# Altium schematic sheet TestKitSch.SchDoc
size A2
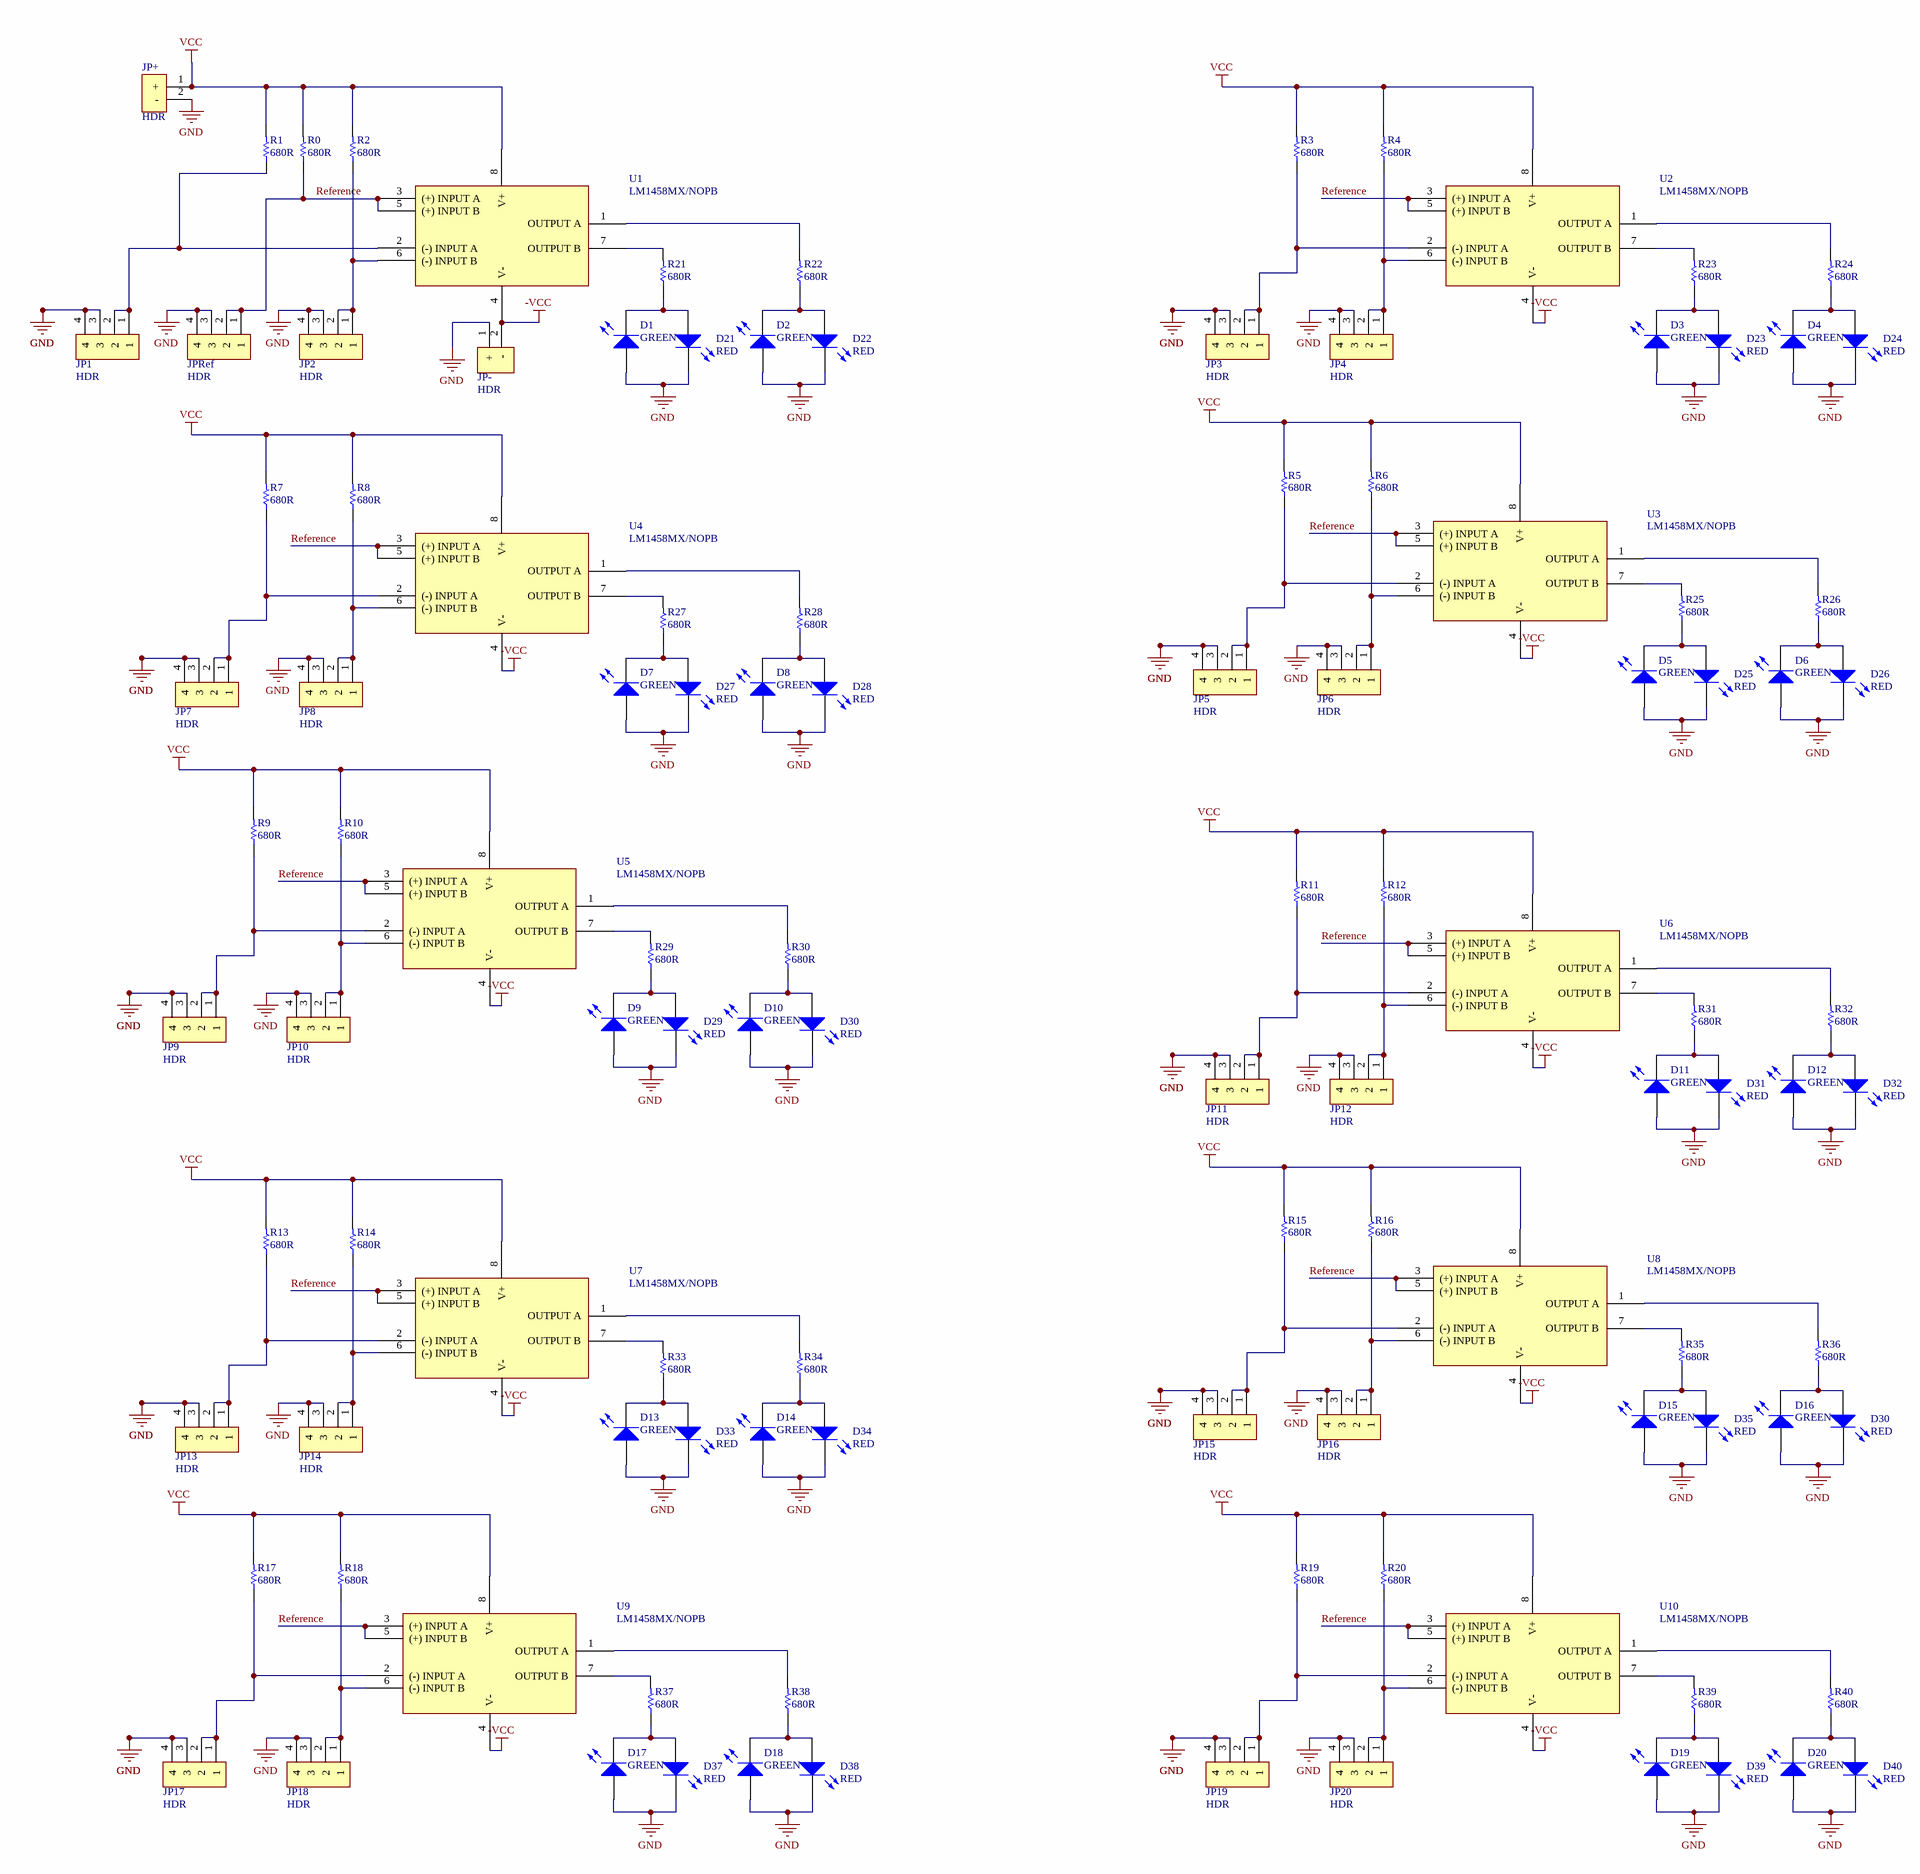
[diagram p0: TestKitSch.SchDoc]

## Parts
(Parts that share a designator on the sheet are numbered #1, #2 ... from top to bottom, then left to right.)
D1  GREEN  [2835_LED_GREEN]
D2  GREEN  [2835_LED_GREEN]
D3  GREEN  [2835_LED_GREEN]
D4  GREEN  [2835_LED_GREEN]
D5  GREEN  [2835_LED_GREEN]
D6  GREEN  [2835_LED_GREEN]
D7  GREEN  [2835_LED_GREEN]
D8  GREEN  [2835_LED_GREEN]
D9  GREEN  [2835_LED_GREEN]
D10  GREEN  [2835_LED_GREEN]
D11  GREEN  [2835_LED_GREEN]
D12  GREEN  [2835_LED_GREEN]
D13  GREEN  [2835_LED_GREEN]
D14  GREEN  [2835_LED_GREEN]
D15  GREEN  [2835_LED_GREEN]
D16  GREEN  [2835_LED_GREEN]
D17  GREEN  [2835_LED_GREEN]
D18  GREEN  [2835_LED_GREEN]
D19  GREEN  [2835_LED_GREEN]
D20  GREEN  [2835_LED_GREEN]
D21  RED  [2835_LED_RED]
D22  RED  [2835_LED_RED]
D23  RED  [2835_LED_RED]
D24  RED  [2835_LED_RED]
D25  RED  [2835_LED_RED]
D26  RED  [2835_LED_RED]
D27  RED  [2835_LED_RED]
D28  RED  [2835_LED_RED]
D29  RED  [2835_LED_RED]
D30#1  RED  [2835_LED_RED]
D30#2  RED  [2835_LED_RED]
D31  RED  [2835_LED_RED]
D32  RED  [2835_LED_RED]
D33  RED  [2835_LED_RED]
D34  RED  [2835_LED_RED]
D35  RED  [2835_LED_RED]
D37  RED  [2835_LED_RED]
D38  RED  [2835_LED_RED]
D39  RED  [2835_LED_RED]
D40  RED  [2835_LED_RED]
JP1  HDR  [Hdr_Famela_1x4_2.54mm]
JP2  HDR  [Hdr_Famela_1x4_2.54mm]
JP3  HDR  [Hdr_Famela_1x4_2.54mm]
JP4  HDR  [Hdr_Famela_1x4_2.54mm]
JP5  HDR  [Hdr_Famela_1x4_2.54mm]
JP6  HDR  [Hdr_Famela_1x4_2.54mm]
JP7  HDR  [Hdr_Famela_1x4_2.54mm]
JP8  HDR  [Hdr_Famela_1x4_2.54mm]
JP9  HDR  [Hdr_Famela_1x4_2.54mm]
JP10  HDR  [Hdr_Famela_1x4_2.54mm]
JP11  HDR  [Hdr_Famela_1x4_2.54mm]
JP12  HDR  [Hdr_Famela_1x4_2.54mm]
JP13  HDR  [Hdr_Famela_1x4_2.54mm]
JP14  HDR  [Hdr_Famela_1x4_2.54mm]
JP15  HDR  [Hdr_Famela_1x4_2.54mm]
JP16  HDR  [Hdr_Famela_1x4_2.54mm]
JP17  HDR  [Hdr_Famela_1x4_2.54mm]
JP18  HDR  [Hdr_Famela_1x4_2.54mm]
JP19  HDR  [Hdr_Famela_1x4_2.54mm]
JP20  HDR  [Hdr_Famela_1x4_2.54mm]
JP+  HDR  [HDR_MALE_2X1_2.54]
JP-  HDR  [HDR_MALE_2X1_2.54]
JPRef  HDR  [Hdr_Famela_1x4_2.54mm]
R0  680R  [R0805]
R1  680R  [R0805]
R2  680R  [R0805]
R3  680R  [R0805]
R4  680R  [R0805]
R5  680R  [R0805]
R6  680R  [R0805]
R7  680R  [R0805]
R8  680R  [R0805]
R9  680R  [R0805]
R10  680R  [R0805]
R11  680R  [R0805]
R12  680R  [R0805]
R13  680R  [R0805]
R14  680R  [R0805]
R15  680R  [R0805]
R16  680R  [R0805]
R17  680R  [R0805]
R18  680R  [R0805]
R19  680R  [R0805]
R20  680R  [R0805]
R21  680R  [R0805]
R22  680R  [R0805]
R23  680R  [R0805]
R24  680R  [R0805]
R25  680R  [R0805]
R26  680R  [R0805]
R27  680R  [R0805]
R28  680R  [R0805]
R29  680R  [R0805]
R30  680R  [R0805]
R31  680R  [R0805]
R32  680R  [R0805]
R33  680R  [R0805]
R34  680R  [R0805]
R35  680R  [R0805]
R36  680R  [R0805]
R37  680R  [R0805]
R38  680R  [R0805]
R39  680R  [R0805]
R40  680R  [R0805]
U1  LM1458MX/NOPB  [SOIC8]
U2  LM1458MX/NOPB  [SOIC8]
U3  LM1458MX/NOPB  [SOIC8]
U4  LM1458MX/NOPB  [SOIC8]
U5  LM1458MX/NOPB  [SOIC8]
U6  LM1458MX/NOPB  [SOIC8]
U7  LM1458MX/NOPB  [SOIC8]
U8  LM1458MX/NOPB  [SOIC8]
U9  LM1458MX/NOPB  [SOIC8]
U10  LM1458MX/NOPB  [SOIC8]

## Nets
-VCC: JP-.2(-) U1.4(V-) U2.4(V-) U3.4(V-) U4.4(V-) U5.4(V-) U6.4(V-) U7.4(V-) U8.4(V-) U9.4(V-) U10.4(V-)
GND: D1.1(A) D2.1(A) D3.1(A) D4.1(A) D5.1(A) D6.1(A) D7.1(A) D8.1(A) D9.1(A) D10.1(A) D11.1(A) D12.1(A) D13.1(A) D14.1(A) D15.1(A) D16.1(A) D17.1(A) D18.1(A) D19.1(A) D20.1(A) D21.2(K) D22.2(K) D23.2(K) D24.2(K) D25.2(K) D26.2(K) D27.2(K) D28.2(K) D29.2(K) D30#1.2(K) D30#2.2(K) D31.2(K) D32.2(K) D33.2(K) D34.2(K) D35.2(K) D37.2(K) D38.2(K) D39.2(K) D40.2(K) JP1.3 JP1.4 JP2.3 JP2.4 JP3.3 JP3.4 JP4.3 JP4.4 JP5.3 JP5.4 JP6.3 JP6.4 JP7.3 JP7.4 JP8.3 JP8.4 JP9.3 JP9.4 JP10.3 JP10.4 JP11.3 JP11.4 JP12.3 JP12.4 JP13.3 JP13.4 JP14.3 JP14.4 JP15.3 JP15.4 JP16.3 JP16.4 JP17.3 JP17.4 JP18.3 JP18.4 JP19.3 JP19.4 JP20.3 JP20.4 JP+.2(-) JP-.1(+) JPRef.3 JPRef.4
VCC: JP+.1(+) R0.2 R1.2 R2.2 R3.2 R4.2 R5.2 R6.2 R7.2 R8.2 R9.2 R10.2 R11.2 R12.2 R13.2 R14.2 R15.2 R16.2 R17.2 R18.2 R19.2 R20.2 U1.8(V+) U2.8(V+) U3.8(V+) U4.8(V+) U5.8(V+) U6.8(V+) U7.8(V+) U8.8(V+) U9.8(V+) U10.8(V+)
Reference: JPRef.1 JPRef.2 R0.1 U1.3((+)_INPUT_A) U1.5((+)_INPUT_B) U2.3((+)_INPUT_A) U2.5((+)_INPUT_B) U3.3((+)_INPUT_A) U3.5((+)_INPUT_B) U4.3((+)_INPUT_A) U4.5((+)_INPUT_B) U5.3((+)_INPUT_A) U5.5((+)_INPUT_B) U6.3((+)_INPUT_A) U6.5((+)_INPUT_B) U7.3((+)_INPUT_A) U7.5((+)_INPUT_B) U8.3((+)_INPUT_A) U8.5((+)_INPUT_B) U9.3((+)_INPUT_A) U9.5((+)_INPUT_B) U10.3((+)_INPUT_A) U10.5((+)_INPUT_B)
NetD1_2: D1.2(K) D21.1(A) R21.1
NetD2_2: D2.2(K) D22.1(A) R22.1
NetD3_2: D3.2(K) D23.1(A) R23.1
NetD4_2: D4.2(K) D24.1(A) R24.1
NetD5_2: D5.2(K) D25.1(A) R25.1
NetD6_2: D6.2(K) D26.1(A) R26.1
NetD7_2: D7.2(K) D27.1(A) R27.1
NetD8_2: D8.2(K) D28.1(A) R28.1
NetD9_2: D9.2(K) D29.1(A) R29.1
NetD10_2: D10.2(K) D30#1.1(A) R30.1
NetD11_2: D11.2(K) D31.1(A) R31.1
NetD12_2: D12.2(K) D32.1(A) R32.1
NetD13_2: D13.2(K) D33.1(A) R33.1
NetD14_2: D14.2(K) D34.1(A) R34.1
NetD15_2: D15.2(K) D35.1(A) R35.1
NetD16_2: D16.2(K) D30#2.1(A) R36.1
NetD17_2: D17.2(K) D37.1(A) R37.1
NetD18_2: D18.2(K) D38.1(A) R38.1
NetD19_2: D19.2(K) D39.1(A) R39.1
NetD20_2: D20.2(K) D40.1(A) R40.1
NetJP1_1: JP1.1 JP1.2 R1.1 U1.2((-)_INPUT_A)
NetJP2_1: JP2.1 JP2.2 R2.1 U1.6((-)_INPUT_B)
NetJP3_1: JP3.1 JP3.2 R3.1 U2.2((-)_INPUT_A)
NetJP4_1: JP4.1 JP4.2 R4.1 U2.6((-)_INPUT_B)
NetJP5_1: JP5.1 JP5.2 R5.1 U3.2((-)_INPUT_A)
NetJP6_1: JP6.1 JP6.2 R6.1 U3.6((-)_INPUT_B)
NetJP7_1: JP7.1 JP7.2 R7.1 U4.2((-)_INPUT_A)
NetJP8_1: JP8.1 JP8.2 R8.1 U4.6((-)_INPUT_B)
NetJP9_1: JP9.1 JP9.2 R9.1 U5.2((-)_INPUT_A)
NetJP10_1: JP10.1 JP10.2 R10.1 U5.6((-)_INPUT_B)
NetJP11_1: JP11.1 JP11.2 R11.1 U6.2((-)_INPUT_A)
NetJP12_1: JP12.1 JP12.2 R12.1 U6.6((-)_INPUT_B)
NetJP13_1: JP13.1 JP13.2 R13.1 U7.2((-)_INPUT_A)
NetJP14_1: JP14.1 JP14.2 R14.1 U7.6((-)_INPUT_B)
NetJP15_1: JP15.1 JP15.2 R15.1 U8.2((-)_INPUT_A)
NetJP16_1: JP16.1 JP16.2 R16.1 U8.6((-)_INPUT_B)
NetJP17_1: JP17.1 JP17.2 R17.1 U9.2((-)_INPUT_A)
NetJP18_1: JP18.1 JP18.2 R18.1 U9.6((-)_INPUT_B)
NetJP19_1: JP19.1 JP19.2 R19.1 U10.2((-)_INPUT_A)
NetJP20_1: JP20.1 JP20.2 R20.1 U10.6((-)_INPUT_B)
NetR21_2: R21.2 U1.7(OUTPUT_B)
NetR22_2: R22.2 U1.1(OUTPUT_A)
NetR23_2: R23.2 U2.7(OUTPUT_B)
NetR24_2: R24.2 U2.1(OUTPUT_A)
NetR25_2: R25.2 U3.7(OUTPUT_B)
NetR26_2: R26.2 U3.1(OUTPUT_A)
NetR27_2: R27.2 U4.7(OUTPUT_B)
NetR28_2: R28.2 U4.1(OUTPUT_A)
NetR29_2: R29.2 U5.7(OUTPUT_B)
NetR30_2: R30.2 U5.1(OUTPUT_A)
NetR31_2: R31.2 U6.7(OUTPUT_B)
NetR32_2: R32.2 U6.1(OUTPUT_A)
NetR33_2: R33.2 U7.7(OUTPUT_B)
NetR34_2: R34.2 U7.1(OUTPUT_A)
NetR35_2: R35.2 U8.7(OUTPUT_B)
NetR36_2: R36.2 U8.1(OUTPUT_A)
NetR37_2: R37.2 U9.7(OUTPUT_B)
NetR38_2: R38.2 U9.1(OUTPUT_A)
NetR39_2: R39.2 U10.7(OUTPUT_B)
NetR40_2: R40.2 U10.1(OUTPUT_A)

## Library data of the parts
D1-D20 = QBHP686-RH: LED Uni-Color Green Automotive 2-Pin T/R; Manufacturer 1: QT-Brightek; Color: Red; Lens Color: Colorless; Lens Style: Flat; Lens Transparency: Clear; Forward Voltage: 2.4V; Test Current: 150mA; Viewing Angle: 120°; Dominant Wavelength: 620nm; Supplier 1: Digi-Key; Stock 1: 2880; Pricing 1: 1=0,85000, 10=0,55300, 100=0,36250, 1000=0,28620 (USD); RoHS: No; Mount: Surface Mount; Case/Package: 1113; Case Code (Imperial): 1113; Packaging: Tape and Reel; Length: 3.1mm; Width: 2.8mm; Height: 1mm; ComponentLink1URL: http://www.qt-brightek.com/datasheet/QBHP686-XXH Series.pdf?src-supplier=Digi-Key; ComponentLink1Description: http://www.qt-brightek.com/datasheet/QBHP686-XXH Series.pdf?src-supplier=Digi-Key; Supplier Part Number 1: 1516-1369-1-ND; Manufacturer Part Number 1: QBHP686-RH
D21-D29 D30#1 D30#2 D31-D35 D37-D40 = QBHP686-RH_1: LED Uni-Color Red Automotive 2-Pin T/R; Manufacturer 1: QT-Brightek; Lens Color: Colorless; Lens Style: Flat; Lens Transparency: Clear; Forward Voltage: 2.4V; Test Current: 150mA; Viewing Angle: 120°; Dominant Wavelength: 620nm; Supplier 1: Digi-Key; Stock 1: 2880; Pricing 1: 1=0,85000, 10=0,55300, 100=0,36250, 1000=0,28620 (USD); RoHS: No; Mount: Surface Mount; Case/Package: 1113; Color: Red; Case Code (Imperial): 1113; Packaging: Tape and Reel; Length: 3.1mm; Width: 2.8mm; Height: 1mm; ComponentLink1URL: http://www.qt-brightek.com/datasheet/QBHP686-XXH Series.pdf?src-supplier=Digi-Key; ComponentLink1Description: http://www.qt-brightek.com/datasheet/QBHP686-XXH Series.pdf?src-supplier=Digi-Key; Supplier Part Number 1: 1516-1369-1-ND; Manufacturer Part Number 1: QBHP686-RH
JP1-JP20 JPRef = M20-7820446: 2.54mm (0.1") Pitch SIL Vertical PC Tail Socket Assembly, tin, 4 contacts; Manufacturer 1: Harwin; Number of Contacts: 4; Max Current Rating: 3A; Contact Resistance: 20mR; Mating Cycles: 50; Connector Type: Receptacle; Insulation Resistance: 1MR; Hole Diameter: 0.8mm; Supplier 1: Digi-Key; Manufacturer Part Number 1: M20-7820446; Stock 1: 3184; Pricing 1: 1=0,86000, 54=0,68593, 108=0,65602, 486=0,53677, 972=0,47712, 4914=0,41748, 9828=0,39760 (USD); RoHS: Yes; Mount: Through Hole; Case/Package: SIL; Contact Plating: Tin; Contact Material: Bronze; Color: Black; Housing Color: Black; Housing Material: Polyamide; Min Operating Temperature: -40°C; Max Operating Temperature: 105°C; Number of Rows: 1; Termination: Solder; Packaging: Rail/Tube; Package Quantity: 56; Contact Gender: Female; Current Rating: 3A; Number of Positions: 4; Gender: Receptacle; Orientation: Straight; Series: M20; Contact Type: Female Socket; Length: 10.56mm; Pitch: 2.54mm; Lead Pitch: 2.54mm; Depth: 2.5mm; REACH SVHC: No SVHC; RoHS Compliant: Yes; ComponentLink1URL: https://datasheet.ciiva.com/11747/0900766b80dc1d2b-11747084.pdf?src-supplier=RSComponents; ComponentLink1Description: https://datasheet.ciiva.com/11747/0900766b80dc1d2b-11747084.pdf?src-supplier=RSComponents; ComponentLink2URL: https://datasheet.ciiva.com/16657/m20-782-16657321.pdf?src-supplier=Avnet+Europe; ComponentLink2Description: https://datasheet.ciiva.com/16657/m20-782-16657321.pdf?src-supplier=Avnet+Europe; ComponentLink3URL: https://datasheet.ciiva.com/7639/1836950-7639727.pdf?src-supplier=Element14; ComponentLink3Description: https://datasheet.ciiva.com/7639/1836950-7639727.pdf?src-supplier=Element14; ComponentLink4URL: https://datasheet.ciiva.com/6784/m20-782-6784360.pdf?src-supplier=Digi-Key; ComponentLink4Description: https://datasheet.ciiva.com/6784/m20-782-6784360.pdf?src-supplier=Digi-Key; ComponentLink5URL: https://datasheet.ciiva.com/10151/m20-782-10151359.pdf?src-supplier=Avnet; ComponentLink5Description: https://datasheet.ciiva.com/10151/m20-782-10151359.pdf?src-supplier=Avnet; Supplier Part Number 1: 952-1792-ND
JP+ JP- = 640456-2: Connector 250V AC/DC 5A 2P 1 Row PCB - Vertical Mounting Polyester White; Manufacturer 1: TE Connectivity; Number of Contacts: 2; Gender: Male; Connector Type: Connector,Pin,Plug,Header; Contact Resistance: 6mR; Mating Alignment: No (Without); PCB Mount Retention: Without; Mating Connector Lock: Yes (With); Connector System: Wire-to-Board; Circuit Application: Signal; Contact Style: Straight; Pitch: 2.54mm; Contact Post Length: 3.56mm; PCB Thickness: 0.063inch; Tail Length: 0.14inch; Plating Thickness: 3.81um; Approvals: CSA; Supplier 1: Digi-Key; Manufacturer Part Number 1: 640456-2; Stock 1: 94059; Pricing 1: 1=0,13000, 10=0,10100, 100=0,07480, 500=0,06188, 1000=0,05415, 5000=0,04641, 10000=0,04512 (USD); RoHS: Yes; Mount: Through Hole; Contact Plating: Tin; Contact Material: Copper Alloy; Housing Material: Polyester; Color: Natural,White,Beige; Housing Color: Natural; Contact Shape: Square; Min Operating Temperature: -67°C; Max Operating Temperature: 221°C; Orientation: Straight; Number of Rows: 1; Packaging: Bulk; Termination: Solder; Number of Positions: 2; Package Quantity: 5000; Series: MTA-100; Contact Type: Male Pin; Current Rating: 5A; Contact Gender: Male; Max Voltage Rating (AC): 250V; Voltage Rating: 250V; PCB Mounting Orientation: Vertical; Contact Current Rating: 5A; Fastening Type: Friction; Voltage Rating (AC): 250V; Strain Relief: No (Without); Working Voltage: 250V; Mating Retention: No (Without); PCB Mount Alignment: No (Without); Shrouded: No (Without); Number of Poles: 2; Backwall/Post Interruptions: No (Without); Contact Retention: No (Without); Panel Mount Retention: No (Without); Sealable: No (Without); Mounting Ears: No (Without); Length: 7.62mm; Height: 7.87mm; Contact Mating Length: 7.49mm; Depth: 5.72mm; Lead Pitch: 2.54mm; Radiation Hardening: No; RoHS Compliant: Yes; REACH SVHC: No SVHC; Lead Free: Lead Free; Flammability Rating: UL94 V-0; ELV: Compliant; ComponentLink1URL: https://datasheet.ciiva.com/709/eng-cd-640456-w1-709680.pdf?src-supplier=Digi-Key; ComponentLink1Description: https://datasheet.ciiva.com/709/eng-cd-640456-w1-709680.pdf?src-supplier=Digi-Key; ComponentLink2URL: https://datasheet.ciiva.com/3118/eng-ds-82056-mta-0608-3118497.pdf?src-supplier=Avnet; ComponentLink2Description: https://datasheet.ciiva.com/3118/eng-ds-82056-mta-0608-3118497.pdf?src-supplier=Avnet; ComponentLink3URL: https://datasheet.ciiva.com/25617/0900766b80027008-25617244.pdf?src-supplier=RSComponents; ComponentLink3Description: https://datasheet.ciiva.com/25617/0900766b80027008-25617244.pdf?src-supplier=RSComponents; ComponentLink4URL: https://datasheet.ciiva.com/14156/04384301-14156820.pdf?src-supplier=Distrelec; ComponentLink4Description: https://datasheet.ciiva.com/14156/04384301-14156820.pdf?src-supplier=Distrelec; ComponentLink5URL: https://datasheet.ciiva.com/11746/0900766b80eb7fdd-11746365.pdf?src-supplier=RSComponents; ComponentLink5Description: https://datasheet.ciiva.com/11746/0900766b80eb7fdd-11746365.pdf?src-supplier=RSComponents; ComponentLink6URL: https://datasheet.ciiva.com/16401/eng-ds-82056-mta-0608-16401289.pdf?src-supplier=Future+Electronics; ComponentLink6Description: https://datasheet.ciiva.com/16401/eng-ds-82056-mta-0608-16401289.pdf?src-supplier=Future+Electronics; ComponentLink7URL: https://datasheet.ciiva.com/7128/1866390-7128742.pdf?src-supplier=Newark; ComponentLink7Description: https://datasheet.ciiva.com/7128/1866390-7128742.pdf?src-supplier=Newark; ComponentLink8URL: https://datasheet.ciiva.com/16505/eng-ds-82056-mta-0608-16505419.pdf?src-supplier=Avnet+Asia; ComponentLink8Description: https://datasheet.ciiva.com/16505/eng-ds-82056-mta-0608-16505419.pdf?src-supplier=Avnet+Asia; Supplier Part Number 1: A1921-ND
R0-R40 = RC0805FR-13680RL: Surface Mount Thick Film Chip Resistors; Manufacturer 1: Yageo; Tolerance: 1%; Temperature Coefficient: 100ppm/°C; Power Rating: 125mW; Voltage Rating: 150V; Supplier 1: Digi-Key; Manufacturer Part Number 1: RC0805FR-13680RL; Stock 1: 19000; Pricing 1: 1=0,10000, 10=0,04200, 100=0,01690, 1000=0,00759, 2500=0,00659, 5000=0,00544 (USD); RoHS: Yes; Case/Package: 0805; Contact Plating: Tin,Matte; Case Code (Imperial): 0805; Case Code (Metric): 2012; Min Operating Temperature: -55°C; Max Operating Temperature: 155°C; Resistance: 680R; Resistor Type: Thick Film; Packaging: Tape and Reel; Termination: SMD/SMT; Series: RC; Length: 2mm; Width: 1.25mm; Height: 0.5mm; Radiation Hardening: No; RoHS Compliant: Yes; ComponentLink1URL: http://www.mouser.com/ds/2/447/Yageo_08112016_RC0805-968729.pdf?src-supplier=Mouser; ComponentLink1Description: http://www.mouser.com/ds/2/447/Yageo_08112016_RC0805-968729.pdf?src-supplier=Mouser; ComponentLink2URL: http://www.yageo.com/documents/recent/PYu-RC_Group_51_RoHS_L_2.pdf?src-supplier=Avnet; ComponentLink2Description: http://www.yageo.com/documents/recent/PYu-RC_Group_51_RoHS_L_2.pdf?src-supplier=Avnet; Supplier Part Number 1: 13-RC0805FR-13680RLCT-ND
U1-U10 = LM1458MX/NOPB (2): Dual 36V general-purpose operational amplifier 8-SOIC 0 to 70; Manufacturer 1: TI National Semiconductor; Gain Bandwidth Product: 1MHz; Slew Rate: 0.5V/µs; Common Mode Rejection Ratio: 70dB; Number of Channels: 2; Min Dual Supply Voltage: 3V; Output Current: 45mA; Max Supply Voltage: 18V; Nominal Supply Current: 3mA; Input Offset Voltage (Vos): 6mV; Input Bias Current: 800nA; Voltage Gain: 104.08dB; Power Dissipation: 500mW; Power Supply Rejection Ratio (PSRR): 77dB; Max Power Dissipation: 400mW; Amplifier Type: GENERAL PURPOSE; Supplier 1: Digi-Key; Stock 1: 4409; Pricing 1: 1=1,24000, 10=1,10700, 25=1,05080, 100=0,86310, 250=0,80676, 500=0,71296, 1000=0,61950 (USD); RoHS: Yes; Mount: Surface Mount; Case/Package: SOIC; Number of Pins: 8; Contact Plating: Tin; Min Operating Temperature: 0°C; Max Operating Temperature: 70°C; Bandwidth: 1MHz; Packaging: Tape and Reel; Number of Circuits: 2; Package Quantity: 2500; Max Dual Supply Voltage: 18V; Unity Gain Bandwidth Product: 1MHz; Operating Supply Current: 3mA; Number of Amplifiers: 2; Number of Elements: 2; Technology: BIPOLAR; Radiation Hardening: No; REACH SVHC: No SVHC; Lead Free: Lead Free; RoHS Compliant: Yes; ComponentLink1URL: https://datasheet.ciiva.com/26846/lm1458mx-nopb-26846585.pdf?src-supplier=IIIC; ComponentLink1Description: https://datasheet.ciiva.com/26846/lm1458mx-nopb-26846585.pdf?src-supplier=IIIC; ComponentLink2URL: https://datasheet.ciiva.com/6631/lm1458-6631087.pdf?src-supplier=Digi-Key; ComponentLink2Description: https://datasheet.ciiva.com/6631/lm1458-6631087.pdf?src-supplier=Digi-Key; ComponentLink3URL: https://datasheet.ciiva.com/6631/lm1458-6631085.pdf?src-supplier=Digi-Key; ComponentLink3Description: https://datasheet.ciiva.com/6631/lm1458-6631085.pdf?src-supplier=Digi-Key; Manufacturer Part Number 1: LM1458MX/NOPB; Supplier Part Number 1: LM1458MX/NOPBCT-ND